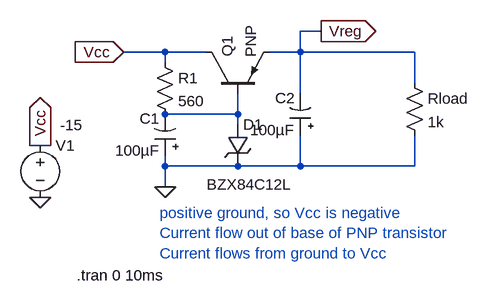
[diagram p0: schematic zener-voltage-regulation-PNP.asc]
zener-voltage-regulation-PNP.asc, the LTspice schematic file:
Version 4
SHEET 1 880 680
WIRE 448 144 416 144
WIRE 208 176 144 176
WIRE 272 176 208 176
WIRE 416 176 416 144
WIRE 416 176 368 176
WIRE 592 176 416 176
WIRE 208 192 208 176
WIRE 592 224 592 176
WIRE 416 240 416 176
WIRE 320 272 320 240
WIRE 320 272 208 272
WIRE 320 288 320 272
WIRE 208 352 208 336
WIRE 320 352 208 352
WIRE 416 352 416 304
WIRE 416 352 320 352
WIRE 592 352 592 304
WIRE 592 352 416 352
WIRE 208 384 208 352
FLAG 208 384 0
FLAG 16 400 0
FLAG 16 320 Vcc
IOPIN 16 320 Out
FLAG 144 176 Vcc
IOPIN 144 176 In
FLAG 448 144 Vreg
IOPIN 448 144 Out
SYMBOL Res 192 176 R0
SYMATTR InstName R1
SYMATTR Value 560
SYMBOL zener 304 288 R0
WINDOW 3 -32 92 Left 2
SYMATTR Value BZX84C12L
SYMATTR InstName D1
SYMBOL Voltage 16 304 R0
WINDOW 3 31 -15 Left 2
SYMATTR Value -15
SYMATTR InstName V1
SYMBOL Res 576 208 R0
SYMATTR InstName Rload
SYMATTR Value 1k
SYMBOL pnp 272 240 R270
SYMATTR InstName Q1
SYMBOL polcap 224 336 R180
WINDOW 0 24 57 Left 2
WINDOW 3 24 8 Left 2
SYMATTR InstName C1
SYMATTR Value 100µF
SYMBOL polcap 432 304 R180
WINDOW 0 24 57 Left 2
WINDOW 3 24 8 Left 2
SYMATTR InstName C2
SYMATTR Value 100µF
TEXT 72 520 Left 2 !.tran 0 10ms
TEXT 200 424 Left 2 ;positive ground, so Vcc is negative\nCurrent flow out of base of PNP transistor\nCurrent flows from ground to Vcc

The netlist it stands for:
* zener-voltage-regulation-PNP.asc
R1 Vcc N001 560
D1 N001 0 BZX84C12L
V1 Vcc 0 -15
Rload Vreg 0 1k
Q1 Vcc N001 Vreg 0 PNP
C1 0 N001 100µF
C2 0 Vreg 100µF
.model D D
.lib standard.dio
.model NPN NPN
.model PNP PNP
.lib standard.bjt
.tran 0 10ms
* positive ground, so Vcc is negative
* Current flow out of base of PNP transistor
* Current flows from ground to Vcc
.backanno
.end